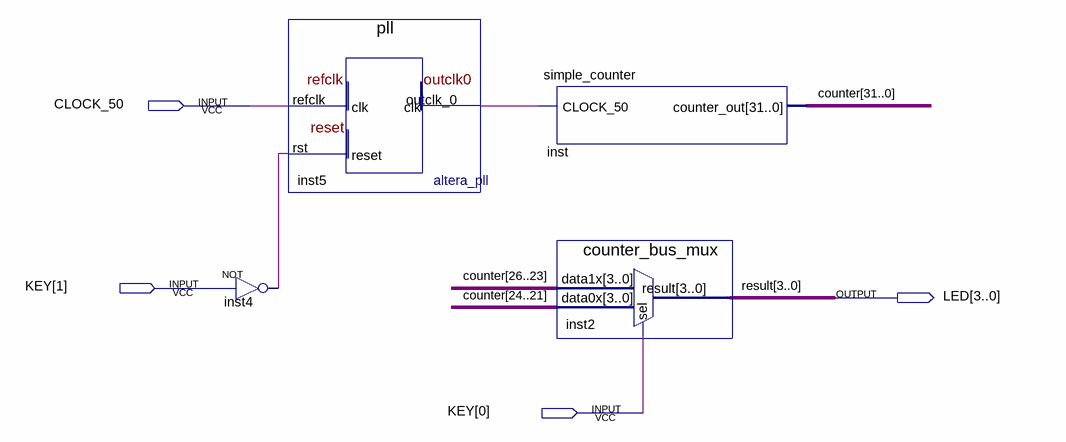
[diagram p0: schematic sheet]
// Quartus schematic my_first_fpga.bdf as structural Verilog: 4 symbols, 4 pins
module my_first_fpga (
  input  CLOCK_50,
  input  [1:0] KEY,
  output [3:0] LED
);

  wire inst4_out, inst5_outclk_0;
  wire [31:0] counter;

  not inst4 (inst4_out, KEY[1]);
  pll inst5 (.refclk(CLOCK_50), .rst(inst4_out), .outclk_0(inst5_outclk_0));
  simple_counter inst (.CLOCK_50(inst5_outclk_0), .counter_out(counter));
  counter_bus_mux inst2 (.data1x(counter[26:23]), .data0x(counter[24:21]), .sel(KEY[0]), .result(LED));

  // Other names for the same wires on the sheet: result[3:0] = LED
endmodule
